# EAGLE design unicorder-temp-mk-2.1 (EAGLE 6.5.0)
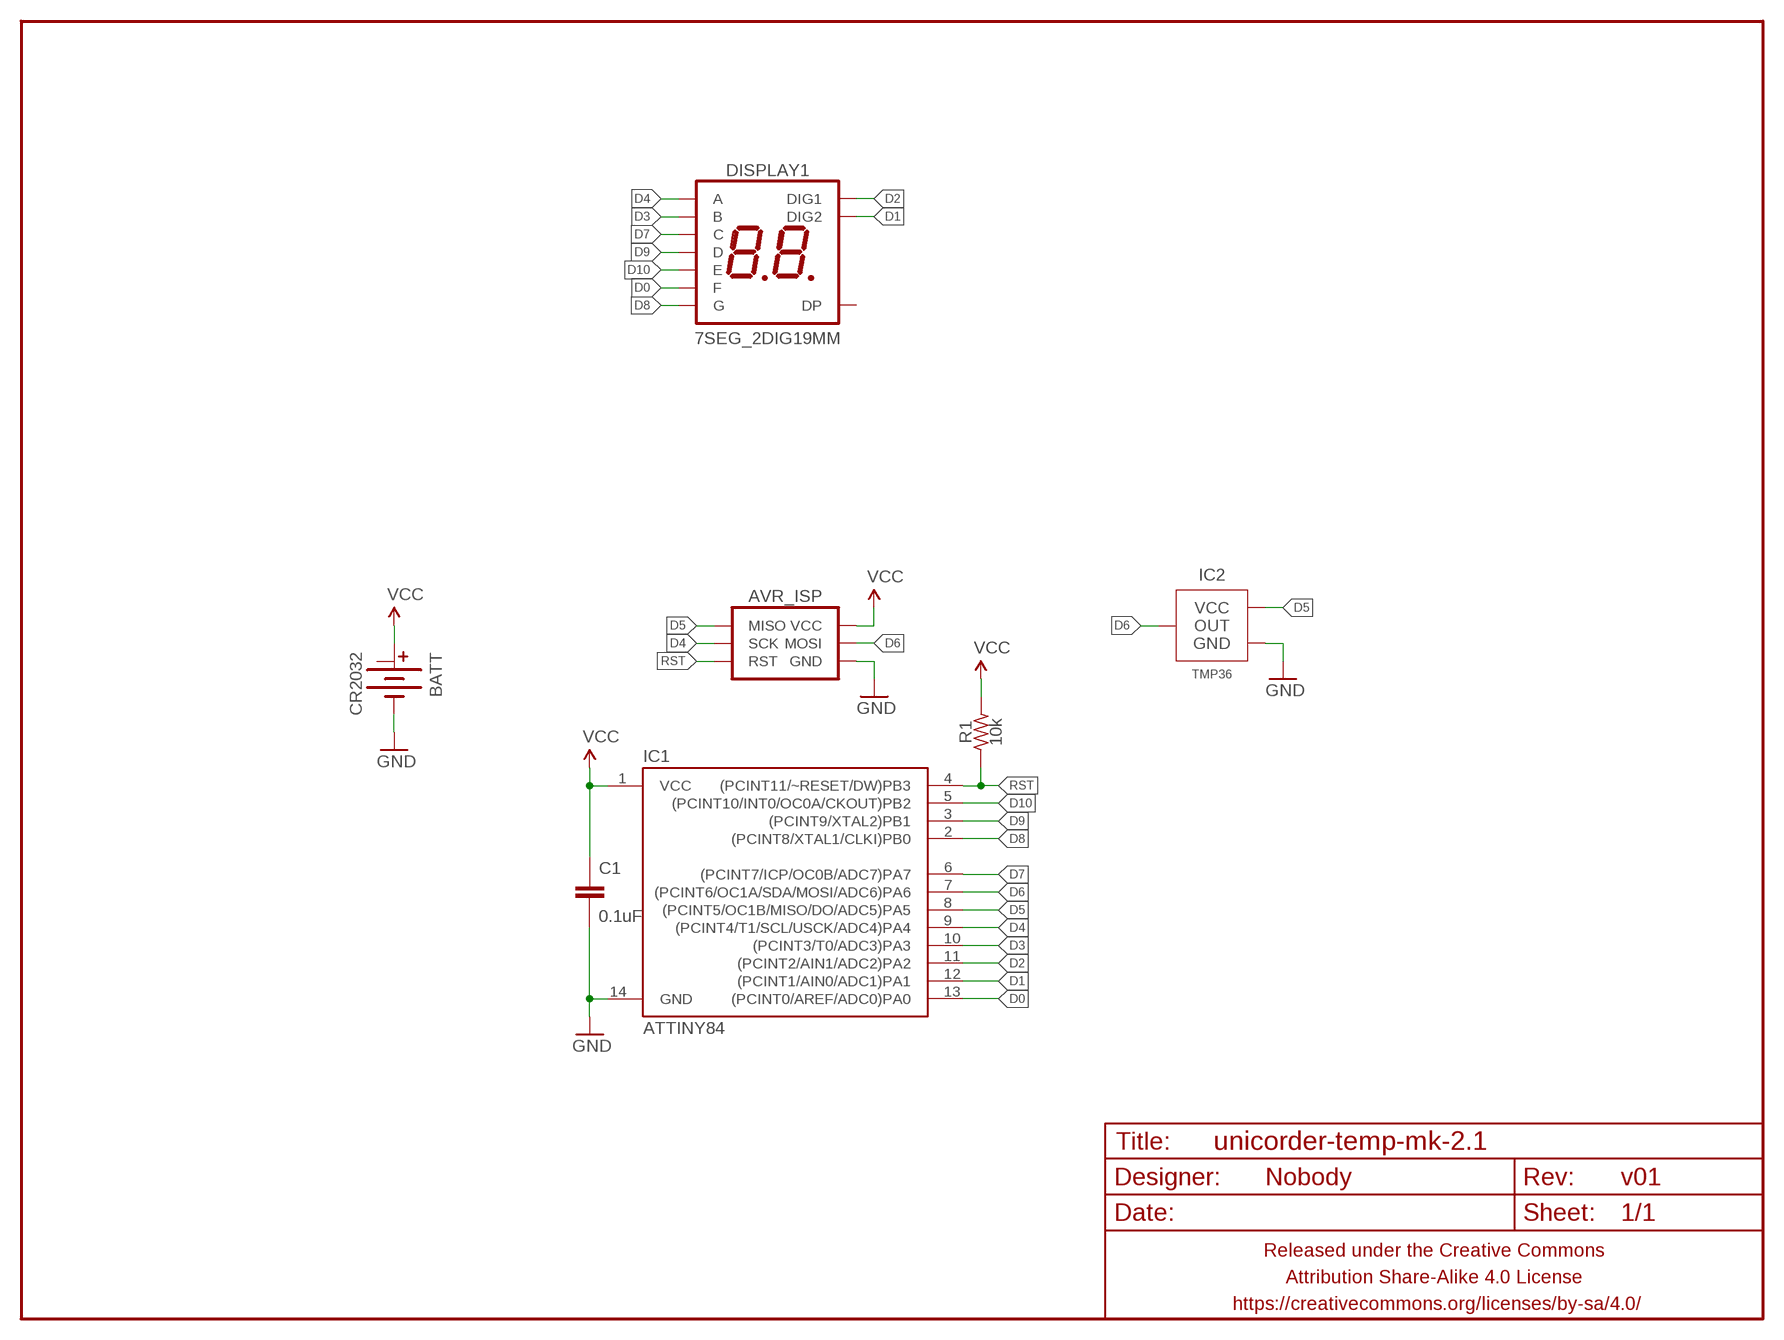
[diagram p0: schematic, sheet 1]

## Parts
AVR_ISP  AVR_SPI_PRG_6JST-PH-VERT-PTH  [JST-6-PH-VERT-PTH]
BATT  CR2032  BATTERY-COINCR2032_SMD  [BATTCON_20MM_MINE]
C1  0.1uF  CAPACITOR-CERAMIC025-024X044  [C025-024X044]
DISPLAY1  7SEG_2DIG19MM  [7SEG_2DIG_19MM]
FRAME1  FRAME-LETTERNO_PACKAGE  [DUMMY]
IC1  ATTINY84  ATTINY84ATTINY84-20PU  [DIL14]
IC2  TMP36  TMP36TO-92  [TO-92-AMMO]
R1  10k  RESISTORPTH-AXIAL-7.62MM  [RESISTOR-AXIAL-PTH-7.62MM]

## Nets
D0: DISPLAY1.6(F) IC1.13((PCINT0/AREF/ADC0)PA0)
D1: DISPLAY1.7(DIG2) IC1.12((PCINT1/AIN0/ADC1)PA1)
D2: DISPLAY1.8(DIG1) IC1.11((PCINT2/AIN1/ADC2)PA2)
D3: DISPLAY1.9(B) IC1.10((PCINT3/T0/ADC3)PA3)
D4: AVR_ISP.3(SCK) DISPLAY1.10(A) IC1.9((PCINT4/T1/SCL/USCK/ADC4)PA4)
D5: AVR_ISP.1(MISO) IC1.8((PCINT5/OC1B/MISO/DO/ADC5)PA5) IC2.1(VCC)
D6: AVR_ISP.4(MOSI) IC1.7((PCINT6/OC1A/SDA/MOSI/ADC6)PA6) IC2.2(OUT)
D7: DISPLAY1.1(C) IC1.6((PCINT7/ICP/OC0B/ADC7)PA7)
D8: DISPLAY1.5(G) IC1.2((PCINT8/XTAL1/CLKI)PB0)
D9: DISPLAY1.4(D) IC1.3((PCINT9/XTAL2)PB1)
D10: DISPLAY1.3(E) IC1.5((PCINT10/INT0/OC0A/CKOUT)PB2)
GND: AVR_ISP.6(GND) BATT.BOTTOM(-) C1.2 IC1.14(GND) IC2.3(GND)
RST: AVR_ISP.5(RST) IC1.4((PCINT11/~RESET/DW)PB3) R1.P$1
VCC: AVR_ISP.2(VCC) BATT.TOP@1(+) C1.1 IC1.1(VCC) R1.P$2
Unconnected: BATT.TOP@2(+1) DISPLAY1.2(DP)

## Library data of the parts
AVR_ISP = A_butts:AVR_SPI_PRG_6: AVR ISP 6 Pin This is the reduced ISP connector for AVR programming. Common on Arduino. This footprint will take up less PCB space and can be used with a 10-pin to 6-pin adapter such as SKU: BOB-08508 **Special note about "TEST_POINT" package. The stop mask is on the top side, so if you want your programming test points to be on the bottom of your board, make sure to place this package on the bottom side of the board. This also ensure that the orientation to program from the bottom side will be correct.
BATT = A_butts:BATTERY-COIN
C1 = A_butts:CAPACITOR-CERAMIC: CAPACITOR, European symbol
DISPLAY1 = A_butts:7SEG_2DIG
FRAME1 = A_butts:FRAME-LETTER: Schematic Frame Standard 8.5x11 US Letter frame; DESIGNER: Nobody; VERSION: v01
IC1 = A_butts:ATTINY84: Atmel 14-pin 2/4/8kB flash uC
IC2 = A_butts:TMP36
R1 = A_butts:RESISTOR: RESISTOR, American symbol

## Board
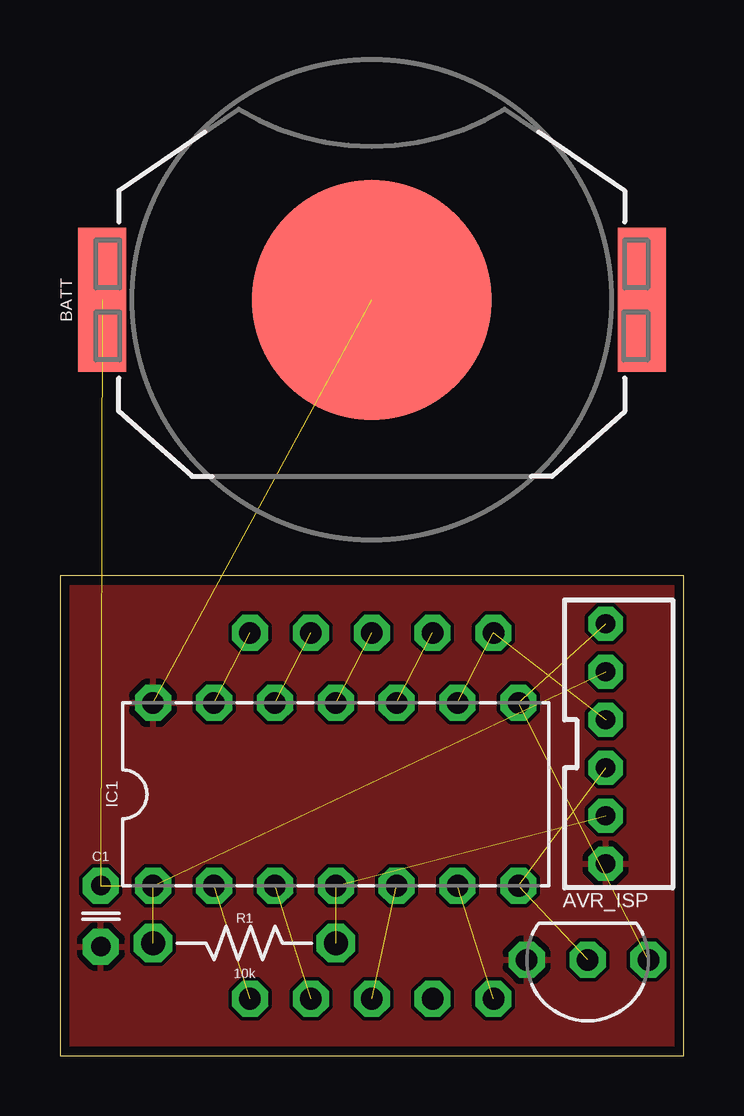
[diagram p1: board, top side]
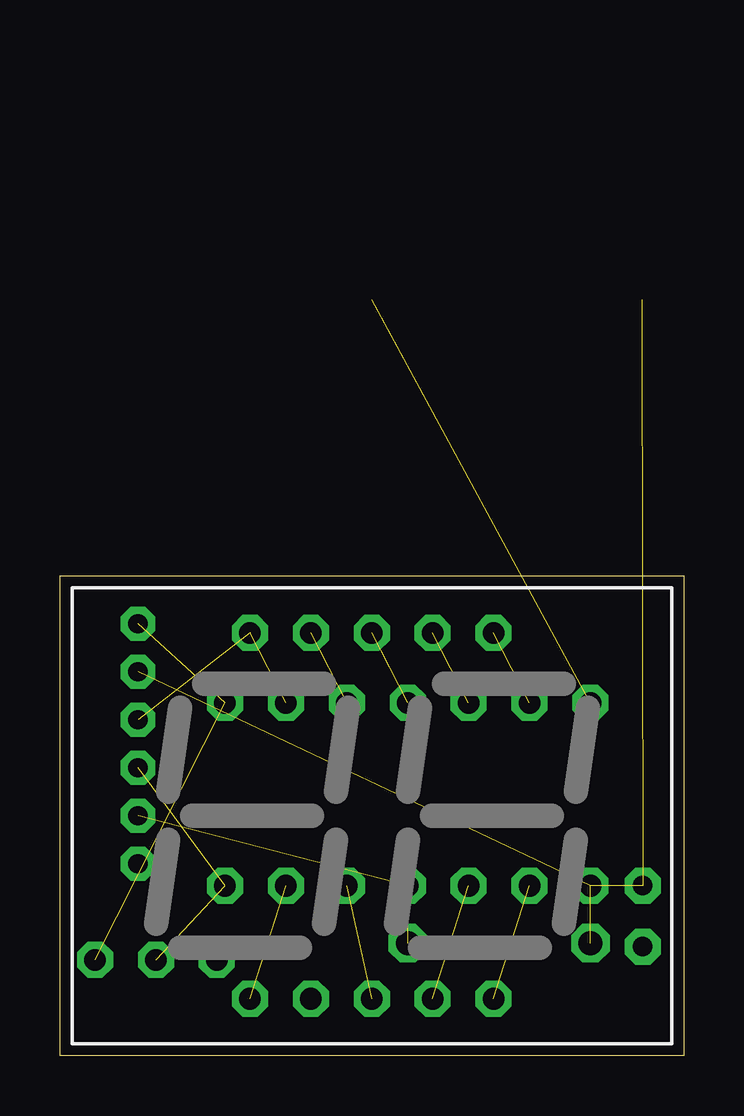
[diagram p2: board, bottom side, seen from below]

Size 26 x 20 mm. Coordinates in mm from the lower left corner, seen from the top.
Outline: 0,0 26,0 26,20 0,20 0,0
Copper layers (1*16): Top 0.0356mm / dielectric 1.5011mm / Bottom 0.0356mm
Design rules "LaenPCBOrder_2": minimum track width 6mil, minimum drill 13mil, track to track 6mil, track to pad 6mil, pad to pad 6mil, via to via 6mil, smd to smd 6mil, copper to edge 15mil, drill to drill 6mil, minimum pad ring 7mil, minimum via ring 7mil, stop-mask expansion 3mil, vias tented up to drill 20mil, thermal gap 10mil

### Footprints (pad centres in the part's own frame; a part is rotated, then mirrored left to right if it is on the bottom)
JST-6-PH-VERT-PTH = drill 0.8 pad 1.422 octagon: 1 -5,0; 2 -3,0; 3 -1,0; 4 1,0; 5 3,0; 6 5,0
BATTCON_20MM_MINE = smd 10 x 10: BOTTOM 0,0 | smd 6 x 2: TOP@1 0,11.25; TOP@2 0,-11.25
C025-024X044 = drill 0.813 pad 1.5 octagon: 1 -1.27,0; 2 1.27,0
7SEG_2DIG_19MM = drill 0.9 pad 1.5 octagon: 1 -5.08,-7.62; 2 -2.54,-7.62; 3 0,-7.62; 4 2.54,-7.62; 5 5.08,-7.62; 6 5.08,7.62; 7 2.54,7.62; 8 0,7.62; 9 -2.54,7.62; 10 -5.08,7.62
DIL14 = drill 0.9 pad 1.5 octagon: 1 -7.62,-3.81; 2 -5.08,-3.81; 3 -2.54,-3.81; 4 0,-3.81; 5 2.54,-3.81; 6 5.08,-3.81; 7 7.62,-3.81; 8 7.62,3.81; 9 5.08,3.81; 10 2.54,3.81; 11 0,3.81; 12 -2.54,3.81; 13 -5.08,3.81; 14 -7.62,3.81
TO-92-AMMO = drill 0.9 pad 1.5 octagon: 1 -2.54,0; 2 0,0; 3 2.54,0
RESISTOR-AXIAL-PTH-7.62MM = drill 1 pad 1.6 octagon: P$1 -3.81,0; P$2 3.81,0

### Placement (x,y rotation side)
AVR_ISP  22.75,13 270 top
BATT  13,31.5 90 top  (outside the outline)
C1  1.7,5.82 270 top
DISPLAY1  13,10 0 bottom
FRAME1  0,0 0 top
IC1  11.5,10.9 0 top
IC2  22,4 180 top
R1  7.69,4.7 180 top

### Tracks (layer width: path | path; a pad name or v marks a point on that pad's centre or on a via)
D0  (1 unrouted)
D1  (1 unrouted)
D2  (1 unrouted)
D3  (1 unrouted)
D4  (2 unrouted)
D5  (2 unrouted)
D6  (2 unrouted)
D7  (1 unrouted)
D8  (1 unrouted)
D9  (1 unrouted)
D10  (1 unrouted)
GND  (1 unrouted)
  pour Top: -0.1,-0.1 -0.1,20.1 26.1,20.1 26.1,-0.1
RST  (2 unrouted)
VCC  (4 unrouted)